# EAGLE schematic IoT-Project_Schema (EAGLE 9.7.0)
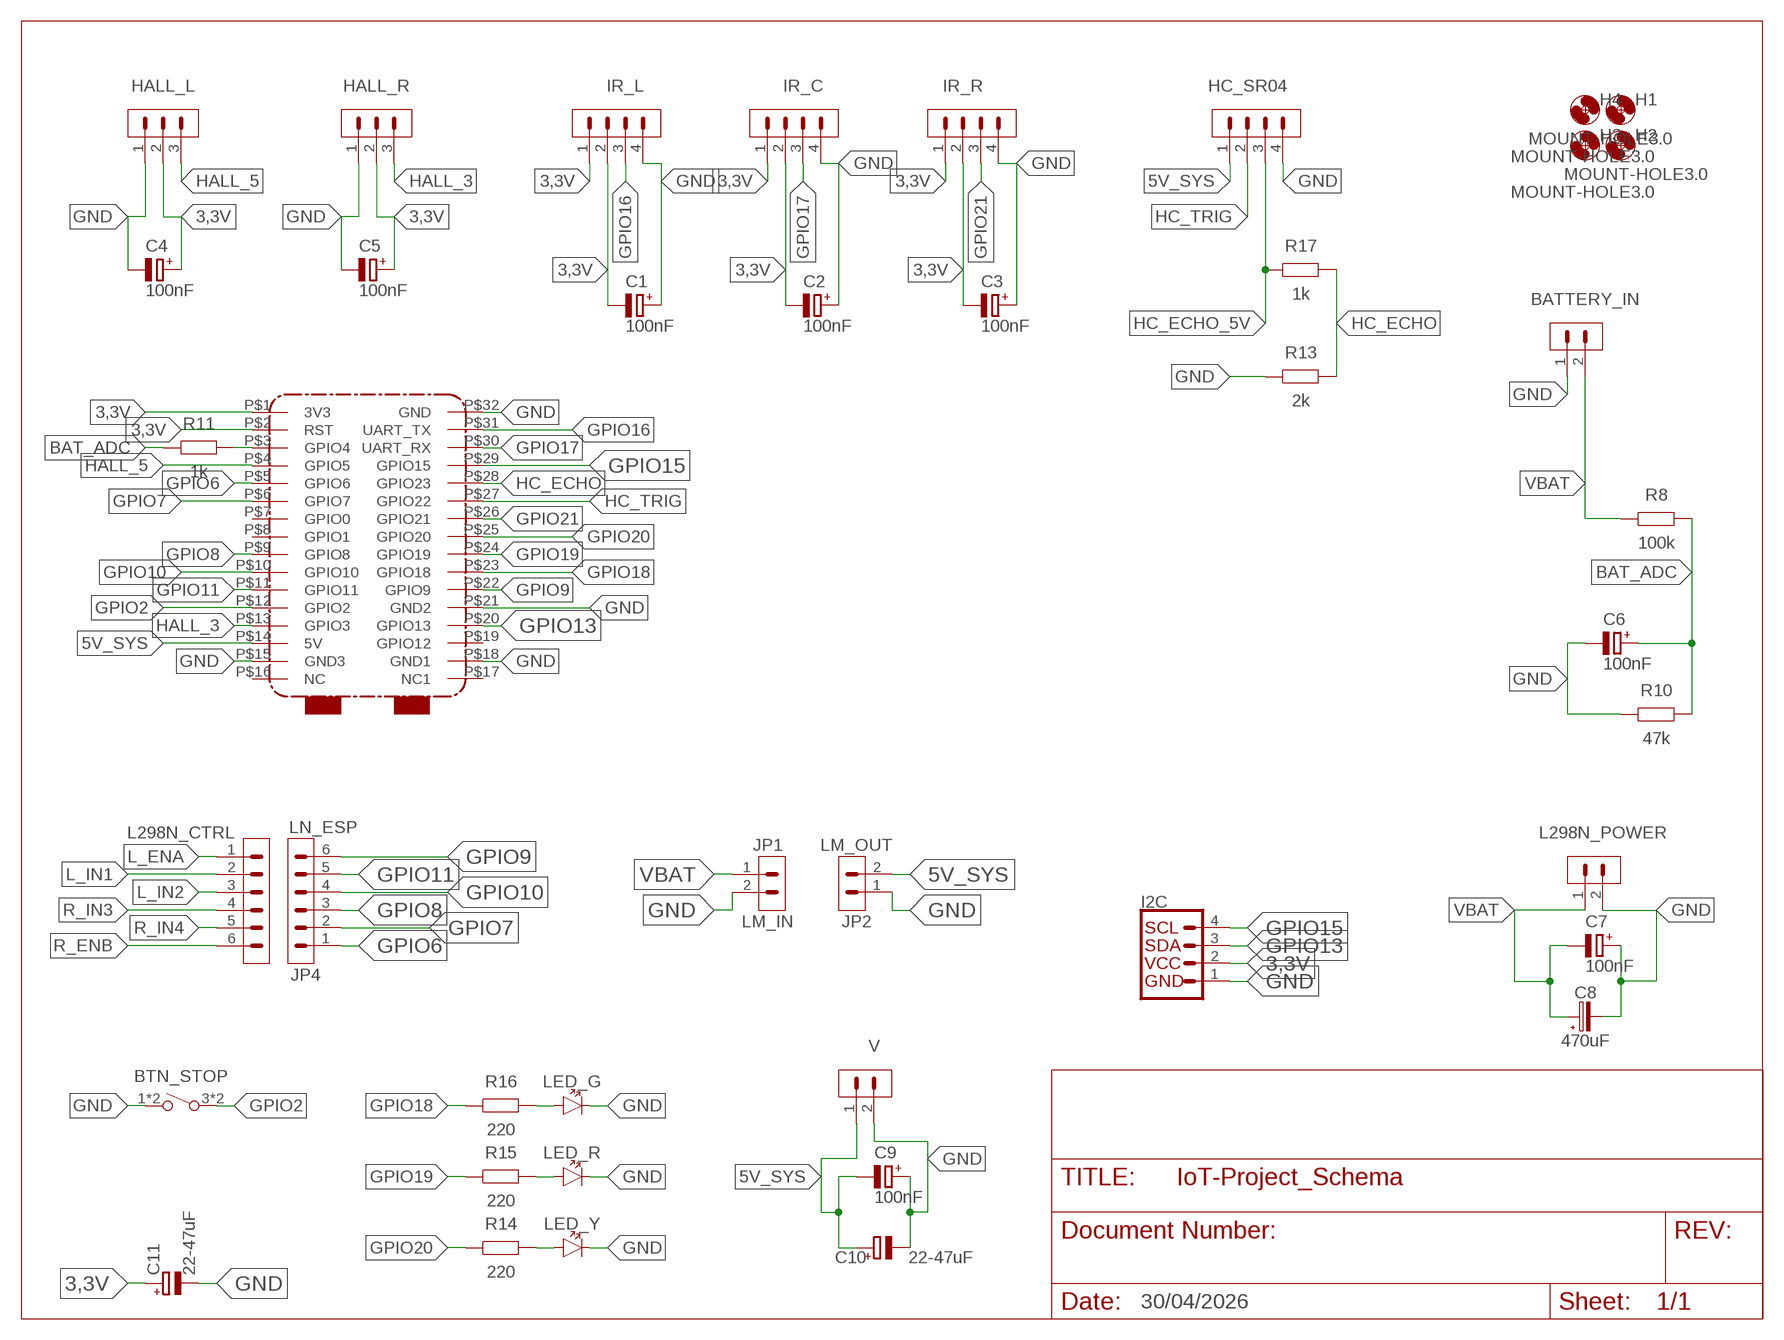
[diagram p0: schematic, sheet 1]

## Parts
BATTERY_IN  PINHD-1X2  [1X02]
BTN_STOP  SPST-NO_SWITCH_PTS645-SMT-6MM  [PTS645-SMT-6MM]
C1  100nF  CAPACITOR-POLRADIAL-5MM-DIA  [CAPPRD254W65D500H1150B]
C2  100nF  CAPACITOR-POLRADIAL-5MM-DIA  [CAPPRD254W65D500H1150B]
C3  100nF  CAPACITOR-POLRADIAL-5MM-DIA  [CAPPRD254W65D500H1150B]
C4  100nF  CAPACITOR-POLRADIAL-5MM-DIA  [CAPPRD254W65D500H1150B]
C5  100nF  CAPACITOR-POLRADIAL-5MM-DIA  [CAPPRD254W65D500H1150B]
C6  100nF  CAPACITOR-POLRADIAL-5MM-DIA  [CAPPRD254W65D500H1150B]
C7  100nF  CAPACITOR-POLRADIAL-5MM-DIA  [CAPPRD254W65D500H1150B]
C8  470uF  C-POL_RADIAL-11MM-DIA  [CAPPRD508W65D1000H1100B]
C9  100nF  CAPACITOR-POLRADIAL-5MM-DIA  [CAPPRD254W65D500H1150B]
C10  22-47uF  CPOL-EUE5-10.5  [E5-10,5]
C11  22-47uF  CPOL-EUE5-10.5  [E5-10,5]
H1  MOUNT-HOLE3.0  [3,0]
H2  MOUNT-HOLE3.0  [3,0]
H3  MOUNT-HOLE3.0  [3,0]
H4  MOUNT-HOLE3.0  [3,0]
HALL_L  PINHD-1X3  [1X03]
HALL_R  PINHD-1X3  [1X03]
HC_SR04  PINHD-1X4  [1X04]
I2C  I2C_STANDARD  [1X04]
IR_C  PINHD-1X4  [1X04]
IR_L  PINHD-1X4  [1X04]
IR_R  PINHD-1X4  [1X04]
JP1  LM_IN  PINHD-1X2  [1X02]
JP2  LM_OUT  PINHD-1X2  [1X02]
JP3  L298N_CTRL  PINHD-1X6  [1X06]
JP4  LN_ESP  PINHD-1X6  [1X06]
L298N_POWER  PINHD-1X2  [1X02]
LED_G  CHIP-ROUND-G_0805  [LEDC2012X105N_RND-G]
LED_R  CHIP-ROUND-R_0805  [LEDC2012X105N_RND-R]
LED_Y  CHIP-ROUND-Y_0805  [LEDC2012X105N_RND-Y]
R8  100k  R_AXIAL-7.2MM-PITCH  [RESAD724W46L381D178B]
R10  47k  R_AXIAL-7.2MM-PITCH  [RESAD724W46L381D178B]
R11  1k  R_AXIAL-7.2MM-PITCH  [RESAD724W46L381D178B]
R13  2k  R_AXIAL-7.2MM-PITCH  [RESAD724W46L381D178B]
R14  220  R_AXIAL-7.2MM-PITCH  [RESAD724W46L381D178B]
R15  220  R_AXIAL-7.2MM-PITCH  [RESAD724W46L381D178B]
R16  220  R_AXIAL-7.2MM-PITCH  [RESAD724W46L381D178B]
R17  1k  R_AXIAL-7.2MM-PITCH  [RESAD724W46L381D178B]
U$1  ESP32_C6_DEVKITC_1ESP32_C6_DEVKIT_C1  [ESP32_C6_DEVKIT_C1]
V  PINHD-1X2  [1X02]

## Nets
3,3V: C1.2(-) C2.2(-) C3.2(-) C4.1(+) C5.1(+) C11.+ HALL_L.2 HALL_R.2 I2C.2 IR_C.1 IR_C.2 IR_L.1 IR_L.2 IR_R.1 IR_R.2 U$1.P$1(3V3) U$1.P$2(RST)
5V_SYS: C9.2(-) C10.+ HC_SR04.1 JP2.2 U$1.P$14(5V) V.1
BAT_ADC: C6.1(+) R8.2 R10.2 R11.1
GND: BATTERY_IN.1 BTN_STOP.1 BTN_STOP.2 C1.1(+) C2.1(+) C3.1(+) C4.2(-) C5.2(-) C6.2(-) C7.1(+) C8.2(-) C9.1(+) C10.- C11.- HALL_L.1 HALL_R.1 HC_SR04.4 I2C.1 IR_C.4 IR_L.4 IR_R.4 JP1.2 JP2.1 L298N_POWER.2 LED_G.C LED_R.C LED_Y.C R10.1 R13.1 U$1.P$15(GND3) U$1.P$18(GND1) U$1.P$21(GND2) U$1.P$32(GND) V.2
GPIO2: BTN_STOP.3 BTN_STOP.4 U$1.P$12(GPIO2)
GPIO6: JP4.1 U$1.P$5(GPIO6)
GPIO7: JP4.2 U$1.P$6(GPIO7)
GPIO8: JP4.3 U$1.P$9(GPIO8)
GPIO9: JP4.6 U$1.P$22(GPIO9)
GPIO10: JP4.4 U$1.P$10(GPIO10)
GPIO11: JP4.5 U$1.P$11(GPIO11)
GPIO13: I2C.3 U$1.P$20(GPIO13)
GPIO15: I2C.4 U$1.P$29(GPIO15)
GPIO16: IR_L.3 U$1.P$31(UART_TX)
GPIO17: IR_C.3 U$1.P$30(UART_RX)
GPIO18: R16.1 U$1.P$23(GPIO18)
GPIO19: R15.1 U$1.P$24(GPIO19)
GPIO20: R14.1 U$1.P$25(GPIO20)
GPIO21: IR_R.3 U$1.P$26(GPIO21)
HALL_3: HALL_R.3 U$1.P$13(GPIO3)
HALL_5: HALL_L.3 U$1.P$4(GPIO5)
HC_ECHO: R13.2 R17.2 U$1.P$28(GPIO23)
HC_ECHO_5V: HC_SR04.3 R17.1
HC_TRIG: HC_SR04.2 U$1.P$27(GPIO22)
L_ENA: JP3.1
L_IN1: JP3.2
L_IN2: JP3.3
N$2: LED_G.A R16.2
N$3: LED_R.A R15.2
N$4: LED_Y.A R14.2
N$7: R11.2 U$1.P$3(GPIO4)
R_ENB: JP3.6
R_IN3: JP3.4
R_IN4: JP3.5
VBAT: BATTERY_IN.2 C7.2(-) C8.1(+) JP1.1 L298N_POWER.1 R8.1
Unconnected: U$1.P$7(GPIO0) U$1.P$8(GPIO1) U$1.P$16(NC) U$1.P$17(NC1) U$1.P$19(GPIO12)

## Notes on the sheet
- 30/04/2026

## Library data of the parts
BATTERY_IN JP1 JP2 L298N_POWER V = Connector:PINHD-1X2: Pin Header
BTN_STOP = Switch:SPST-NO_SWITCH: SPST Switches with NO Configuration
C1-C7 C9 = Tinkercad:CAPACITOR-POL: Capacitor Polarised - Generic
C8 = Capacitor:C-POL: Capacitor Polarised - Generic
C10 C11 = rcl:CPOL-EU: POLARIZED CAPACITOR, European symbol
H1-H4 = holes:MOUNT-HOLE: MOUNTING HOLE with drill center marker
HALL_L HALL_R = Connector:PINHD-1X3: Pin Header
HC_SR04 IR_C IR_L IR_R = Connector:PINHD-1X4: Pin Header
I2C = SparkFun-Connectors:I2C_STANDARD: SparkFun I2C Standard Pinout Header SparkFun has standardized on a pinout for all I2C based sensor breakouts. This pinout allows I2C boards to be plugged directly into the headers on Arduino Uno compatible boards, and to be daisy chained easily. Example SparkFun Products: SparkFun Atmospheric Sensor Breakout - BME280 <https://www.sparkfun.com/products/13676> SparkFun Altitude/Pressure Sensor Breakout - MPL3115A2 <https://www.sparkfun.com/products/11084> SparkFun TOF Range Finder Sensor - VL6180 <https://www.sparkfun.com/products/12785>
JP3 JP4 = Connector:PINHD-1X6: Pin Header
LED_G = LED:CHIP-ROUND-G: Green LED - Generic
LED_R = LED:CHIP-ROUND-R: Red LED - Generic
LED_Y = LED:CHIP-ROUND-Y: Yellow LED - Generic
R8 R10 R11 R13-R17 = Resistor:R: Resistor Fixed - Generic
U$1 = ESP_IoT:ESP32_C6_DEVKITC_1